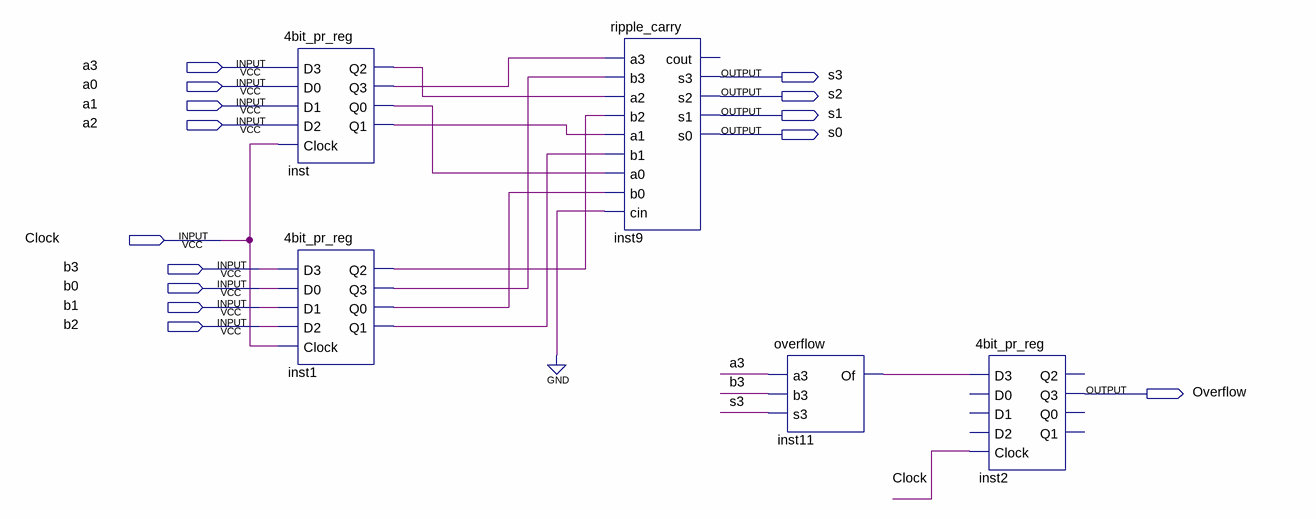
[diagram p0: schematic sheet]
// Quartus schematic AaddB.bdf as structural Verilog: 5 symbols, 14 pins
module AaddB (
  input  a3,
  input  a0,
  input  a1,
  input  a2,
  input  Clock,
  input  b3,
  input  b0,
  input  b1,
  input  b2,
  output s3,
  output s2,
  output s1,
  output s0,
  output Overflow
);

  wire inst1_q0, inst1_q1, inst1_q2, inst1_q3, inst11_of, inst_q0, inst_q1, inst_q2, inst_q3;

  \4bit_pr_reg  inst (
    .D3(a3), .D0(a0), .D1(a1), .D2(a2), .Clock(Clock), .Q2(inst_q2), .Q3(inst_q3), .Q0(inst_q0), .Q1(inst_q1));
  \4bit_pr_reg  inst1 (
    .D3(b3), .D0(b0), .D1(b1), .D2(b2), .Clock(Clock), .Q2(inst1_q2), .Q3(inst1_q3), .Q0(inst1_q0),
    .Q1(inst1_q1));
  ripple_carry inst9 (
    .a3(inst_q3), .b3(inst1_q3), .a2(inst_q2), .b2(inst1_q2), .a1(inst_q1), .b1(inst1_q1), .a0(inst_q0),
    .b0(inst1_q0), .cin(1'b0), .s3(s3), .s2(s2), .s1(s1), .s0(s0));  // open: cout
  overflow inst11 (.a3(a3), .b3(b3), .s3(s3), .Of(inst11_of));
  \4bit_pr_reg  inst2 (.D3(inst11_of), .Clock(Clock), .Q3(Overflow));  // open: D0, D1, D2, Q2, Q0, Q1
endmodule
